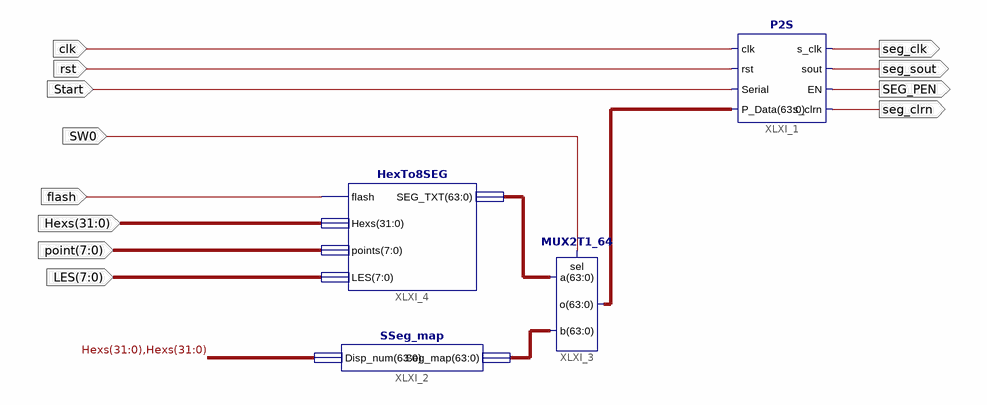
[diagram p0: schematic sheet 1]
// Xilinx ISE schematic Display.sch (kintex7) as structural Verilog: 4 symbols, 12 ports
module Display (
  input  clk,
  input  rst,
  input  SW0,
  input  Start,
  input  flash,
  input  [31:0] Hexs,
  input  [7:0] LES,
  input  [7:0] point,
  output seg_clk,
  output seg_sout,
  output SEG_PEN,
  output seg_clrn
);

  wire [63:0] XLXN_8, XLXN_9, XLXN_17;

  SSeg_map XLXI_2 (.Disp_num({Hexs, Hexs}), .Seg_map(XLXN_8));
  MUX2T1_64 XLXI_3 (.b(XLXN_8), .sel(SW0), .a(XLXN_17), .o(XLXN_9));
  P2S XLXI_1 (
    .s_clrn(seg_clrn), .sout(seg_sout), .rst(rst), .EN(SEG_PEN), .Serial(Start), .clk(clk), .s_clk(seg_clk),
    .P_Data(XLXN_9));
  HexTo8SEG XLXI_4 (.flash(flash), .Hexs(Hexs), .points(point), .LES(LES), .SEG_TXT(XLXN_17));
endmodule
